# EAGLE design Rele-TTL (EAGLE 7.2.0)
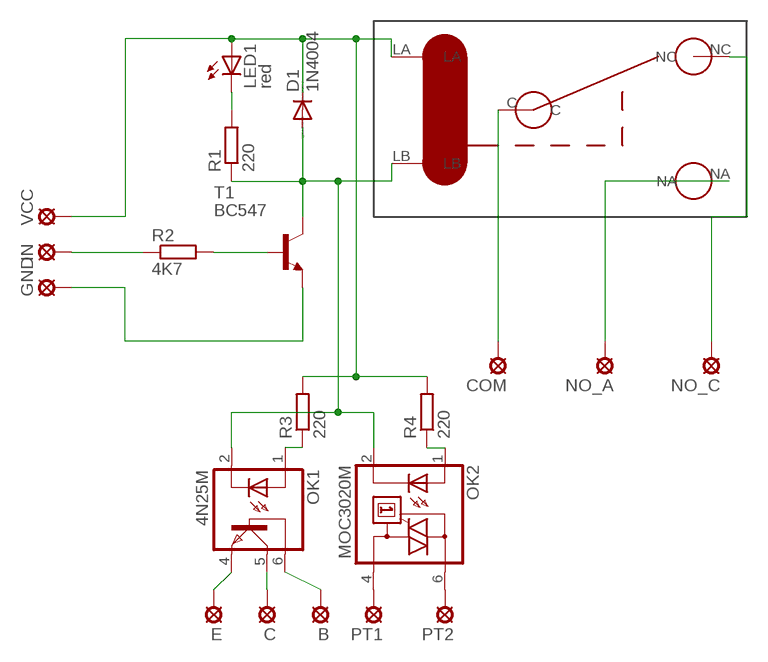
[diagram p0: schematic, sheet 1]

## Parts
B  LSP10  [LSP10]
C  LSP10  [LSP10]
COM  LSP10  [LSP10]
D1  1N4004  [DO41-10]
E  LSP10  [LSP10]
GND  LSP10  [LSP10]
IN  LSP10  [LSP10]
LED1  red  LED5MM  [LED5MM]
NO_A  LSP10  [LSP10]
NO_C  LSP10  [LSP10]
OK1  4N25M  [DIL06]
OK2  MOC3020M  [DIL06]
PT1  LSP10  [LSP10]
PT2  LSP10  [LSP10]
R1  220  R-EU_0207/10  [0207/10]
R2  4K7  R-EU_0207/10  [0207/10]
R3  220  R-EU_0207/10  [0207/10]
R4  220  R-EU_0207/10  [0207/10]
RL1  RELE  [RELE_1]
T1  BC547  [TO92]
VCC  LSP10  [LSP10]

## Nets
N$1: LED1.K(C) R1.2
N$2: COM.MP RL1.C
N$3: R2.2 T1.2(B)
N$4: D1.A OK1.2(C) OK2.2(C) R1.1 RL1.LB T1.3(C)
N$5: NO_A.MP RL1.NA
N$6: NO_C.MP RL1.NC
N$7: IN.MP R2.1
N$10: D1.C LED1.A R3.2 R4.2 RL1.LA VCC.MP
N$11: OK2.1(A) R4.1
N$12: GND.MP T1.1(E)
N$13: OK1.1(A) R3.1
N$15: E.MP OK1.4(EMI)
N$16: C.MP OK1.5(COL)
N$17: OK2.4(A1) PT1.MP
N$18: OK2.6(A2) PT2.MP
N$19: B.MP OK1.6(BAS)

## Library data of the parts
B C COM E GND IN NO_A NO_C PT1 PT2 VCC = solpad:LSP10: SOLDER PAD drill 1.0 mm, distributor Buerklin, 12H555
D1 = diode:1N4004: DIODE general purpose rectifier, 1 A
LED1 = led:LED: LED OSRAM: - CHIPLED LG R971, LG N971, LY N971, LG Q971, LY Q971, LO R971, LY R971 LH N974, LH R974 LS Q976, LO Q976, LY Q976 LO Q996 - Hyper CHIPLED LW Q18S LB Q993, LB Q99A, LB R99A - SideLED LS A670, LO A670, LY A670, LG A670, LP A670 LB A673, LV A673, LT A673, LW A673 LH A674 LY A675 LS A676, LA A676, LO A676, LY A676, LW A676 LS A679, LY A679, LG A679 - Hyper Micro SIDELED® LS Y876, LA Y876, LO Y876, LY Y876 LT Y87S - SmartLED LW L88C, LW L88S LB L89C, LB L89S, LG L890 LS L89K, LO L89K, LY L89K LS L896, LA L896, LO L896, LY L896 - TOPLED LS T670, LO T670, LY T670, LG T670, LP T670 LSG T670, LSP T670, LSY T670, LOP T670, LYG T670 LG T671, LOG T671, LSG T671 LB T673, LV T673, LT T673, LW T673 LH T674 LS T676, LA T676, LO T676, LY T676, LB T676, LH T676, LSB T676, LW T676 LB T67C, LV T67C, LT T67C, LS T67K, LO T67K, LY T67K, LW E67C LS E67B, LA E67B, LO E67B, LY E67B, LB E67C, LV E67C, LT E67C LW T67C LS T679, LY T679, LG T679 LS T770, LO T770, LY T770, LG T770, LP T770 LB T773, LV T773, LT T773, LW T773 LH T774 LS E675, LA E675, LY E675, LS T675 LS T776, LA T776, LO T776, LY T776, LB T776 LHGB T686 LT T68C, LB T68C - Hyper Mini TOPLED® LB M676 - Mini TOPLED Santana® LG M470 LS M47K, LO M47K, LY M47K Source: http://www.osram.convergy.de LUXEON: - LUMILED® LXK2-PW12-R00, LXK2-PW12-S00, LXK2-PW14-U00, LXK2-PW14-V00 LXK2-PM12-R00, LXK2-PM12-S00, LXK2-PM14-U00 LXK2-PE12-Q00, LXK2-PE12-R00, LXK2-PE12-S00, LXK2-PE14-T00, LXK2-PE14-U00 LXK2-PB12-K00, LXK2-PB12-L00, LXK2-PB12-M00, LXK2-PB14-N00, LXK2-PB14-P00, LXK2-PB14-Q00 LXK2-PR12-L00, LXK2-PR12-M00, LXK2-PR14-Q00, LXK2-PR14-R00 LXK2-PD12-Q00, LXK2-PD12-R00, LXK2-PD12-S00 LXK2-PH12-R00, LXK2-PH12-S00 LXK2-PL12-P00, LXK2-PL12-Q00, LXK2-PL12-R00 Source: www.luxeon.com KINGBRIGHT: KA-3528ASYC Source: www.kingbright.com
OK1 = optocoupler:4N*?M: General Purpose 6-Pin Phototransistor Optocouplers Source: http://www.fairchildsemi.com/ds/4N/4N35-M.pdf; MPN: 4N25-M; OC_FARNELL: 1021349; OC_NEWARK: 98K9084
OK2 = optocoupler:MOC30*M: RANDOM-PHASE OPTOISOLATORS TRIAC DRIVER OUTPUT Source: http://www.fairchildsemi.com MOC3020-M.pdf; MF: FAIRCHILD SEMICONDUCTOR; MPN: MOC3020-M; OC_FARNELL: 1505425; OC_NEWARK: 72K8895
R1-R4 = resistor:R-EU_: RESISTOR, European symbol
RL1 = Erik:RELE
T1 = transistor:BC547: NPN TRANSISTOR

## Board
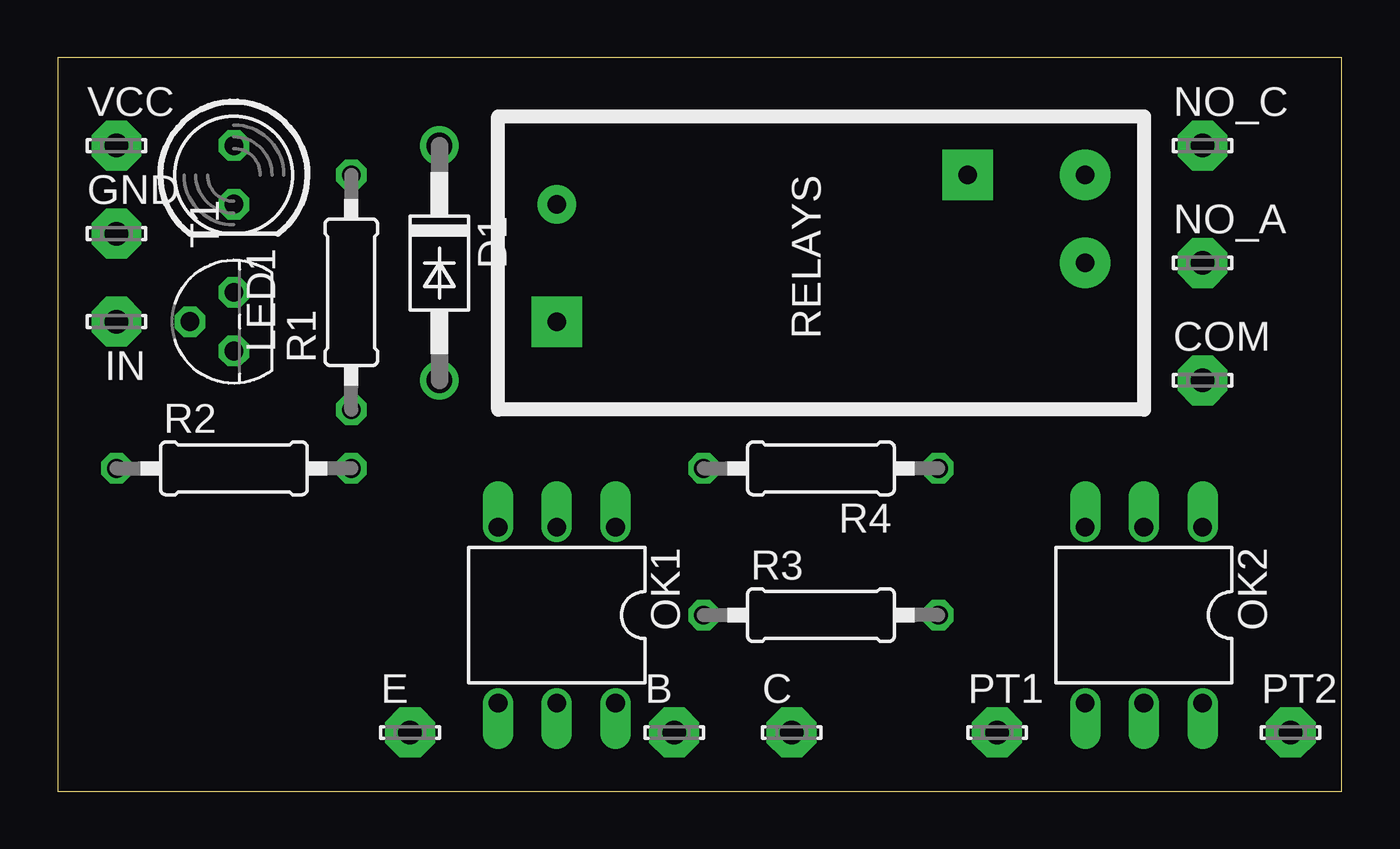
[diagram p1: board, top side]
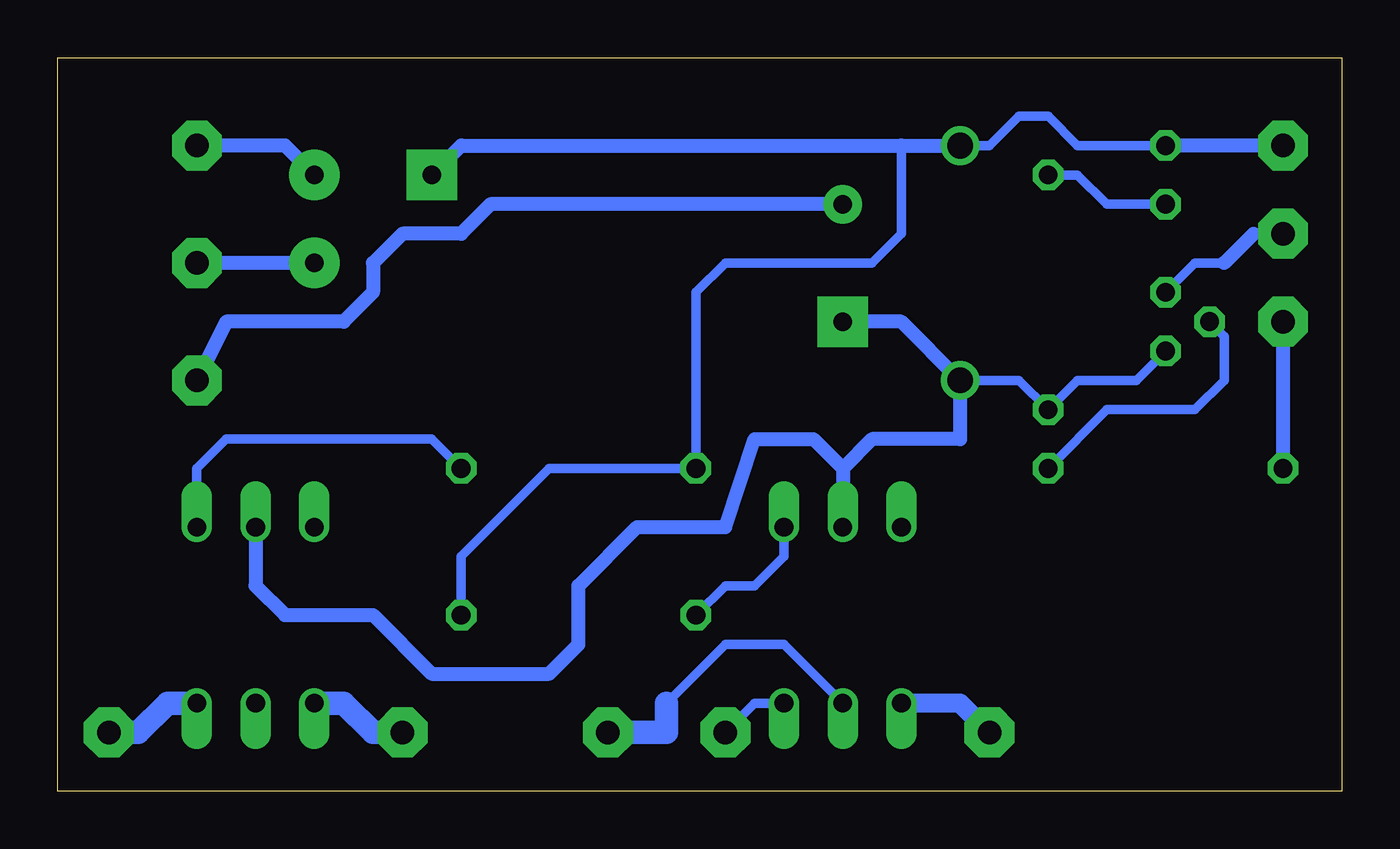
[diagram p2: board, bottom side, seen from below]

Size 55.55 x 31.74 mm. Coordinates in mm from the lower left corner, seen from the top.
Outline: 0,0 55.55,0 55.55,31.74 0,31.74 0,0
Copper layers (1*16): Top 0.035mm / dielectric 1.5mm / Bottom 0.035mm
Design rules "default": minimum track width 10mil, minimum drill 24mil, track to track 8mil, track to pad 8mil, pad to pad 8mil, via to via 8mil, smd to smd 8mil, copper to edge 40mil, drill to drill 8mil, minimum pad ring 10mil, minimum via ring 8mil, stop-mask expansion 4mil, vias tented up to drill 0mil, thermal gap 10mil

### Footprints (pad centres in the part's own frame; a part is rotated, then mirrored left to right if it is on the bottom)
LSP10 = drill 1.016 pad 2.159 octagon: MP 0,0
DO41-10 = drill 1.118: A 5.08,0; C -5.08,0
LED5MM = drill 0.813 octagon: A -1.27,0; K 1.27,0
DIL06 = drill 0.813 offset: 1 -2.54,-3.81; 2 0,-3.81; 3 2.54,-3.81; 4 2.54,3.81; 5 0,3.81; 6 -2.54,3.81
0207/10 = drill 0.813 octagon: 1 -5.08,0; 2 5.08,0
RELE_1 = drill 0.8 pad 1.676: C -8.89,7.62 | drill 0.8 pad 2.184 square: LA -10.16,25.4; LB -3.81,7.62 | drill 0.8 pad 2.184: NA -6.35,30.48; NC -10.16,30.48
TO92 = drill 0.813 octagon: 1 1.27,0; 2 0,1.905; 3 -1.27,0

### Placement (x,y rotation side)
B  26.67,2.54 0 top
C  31.75,2.54 0 top
COM  49.53,17.78 0 top
D1  16.51,22.86 270 top
E  15.24,2.54 0 top
GND  2.54,24.13 0 top
IN  2.54,20.32 180 top
LED1  7.62,26.67 270 top
NO_A  49.53,22.86 0 top
NO_C  49.53,27.94 0 top
OK1  21.59,7.62 180 top
OK2  46.99,7.62 180 top
PT1  40.64,2.54 0 top
PT2  53.34,2.54 0 top
R1  12.7,21.59 90 top
R2  7.62,13.97 0 top
R3  33.02,7.62 0 top
R4  33.02,13.97 180 top
RL1  13.97,16.51 270 top
T1  7.62,20.32 90 top
VCC  2.54,27.94 0 top

### Tracks (layer width: path | path; a pad name or v marks a point on that pad's centre or on a via)
N$1
  Bottom 0.406: LED1.K 10.16,25.4 11.43,26.67 R1.2
N$2
  Bottom 0.61: RL1.C 36.83,25.4 38.1,24.13 40.64,24.13 41.91,22.86 41.91,21.59 43.18,20.32 48.26,20.32 COM.MP
N$3
  Bottom 0.406: T1.2 5.08,19.69 5.08,17.78 6.35,16.51 10.16,16.51 R2.2
N$4
  Bottom 0.406: T1.3 8.89,17.78 11.43,17.78 R1.1 13.97,17.78 D1.A
  Bottom 0.61: RL1.LB 19.05,20.32 D1.A 16.51,15.24 20.32,15.24 21.59,13.97 | 21.59,13.97 OK1.2 | OK2.2 46.99,8.89 45.72,7.62 41.91,7.62 39.37,5.08 34.29,5.08 33.02,6.35 33.02,8.89 30.48,11.43 26.67,11.43 25.4,15.24 22.86,15.24 21.59,13.97
N$5
  Bottom 0.61: RL1.NA NO_A.MP
N$6
  Bottom 0.61: RL1.NC 45.72,27.94 NO_C.MP
N$7
  Bottom 0.61: IN.MP R2.1
N$10
  Bottom 0.406: LED1.A 11.43,27.94 12.7,29.21 13.97,29.21 15.24,27.94 D1.C | R3.2 38.1,10.16 34.29,13.97 R4.2 27.94,21.59 26.67,22.86 20.32,22.86 19.05,24.13 19.05,27.94
  Bottom 0.61: RL1.LA 38.1,27.94 19.05,27.94 D1.C | VCC.MP LED1.A
N$11
  Bottom 0.406: R4.1 39.37,15.24 48.26,15.24 49.53,13.97 OK2.1
N$12
  Bottom 0.406: GND.MP 3.81,24.13 | 5.08,22.86 6.35,22.86 T1.1
  Bottom 0.61: 3.81,24.13 5.08,22.86
N$13
  Bottom 0.406: R3.1 26.67,8.89 25.4,8.89 24.13,10.16 OK1.1
N$15
  Bottom 0.813: E.MP 16.51,3.81 OK1.4
N$16
  Bottom 0.406: OK1.5 24.13,6.35 26.67,6.35 29.21,3.81
  Bottom 1.016: 29.21,3.81 29.21,2.54 C.MP
N$17
  Bottom 1.016: OK2.4 43.18,3.81 41.91,2.54 PT1.MP
N$18
  Bottom 1.016: OK2.6 50.8,3.81 52.07,2.54 PT2.MP
N$19
  Bottom 0.406: OK1.6 25.4,3.81 B.MP